# EAGLE schematic Power Controller 2.0 (EAGLE 6.4)
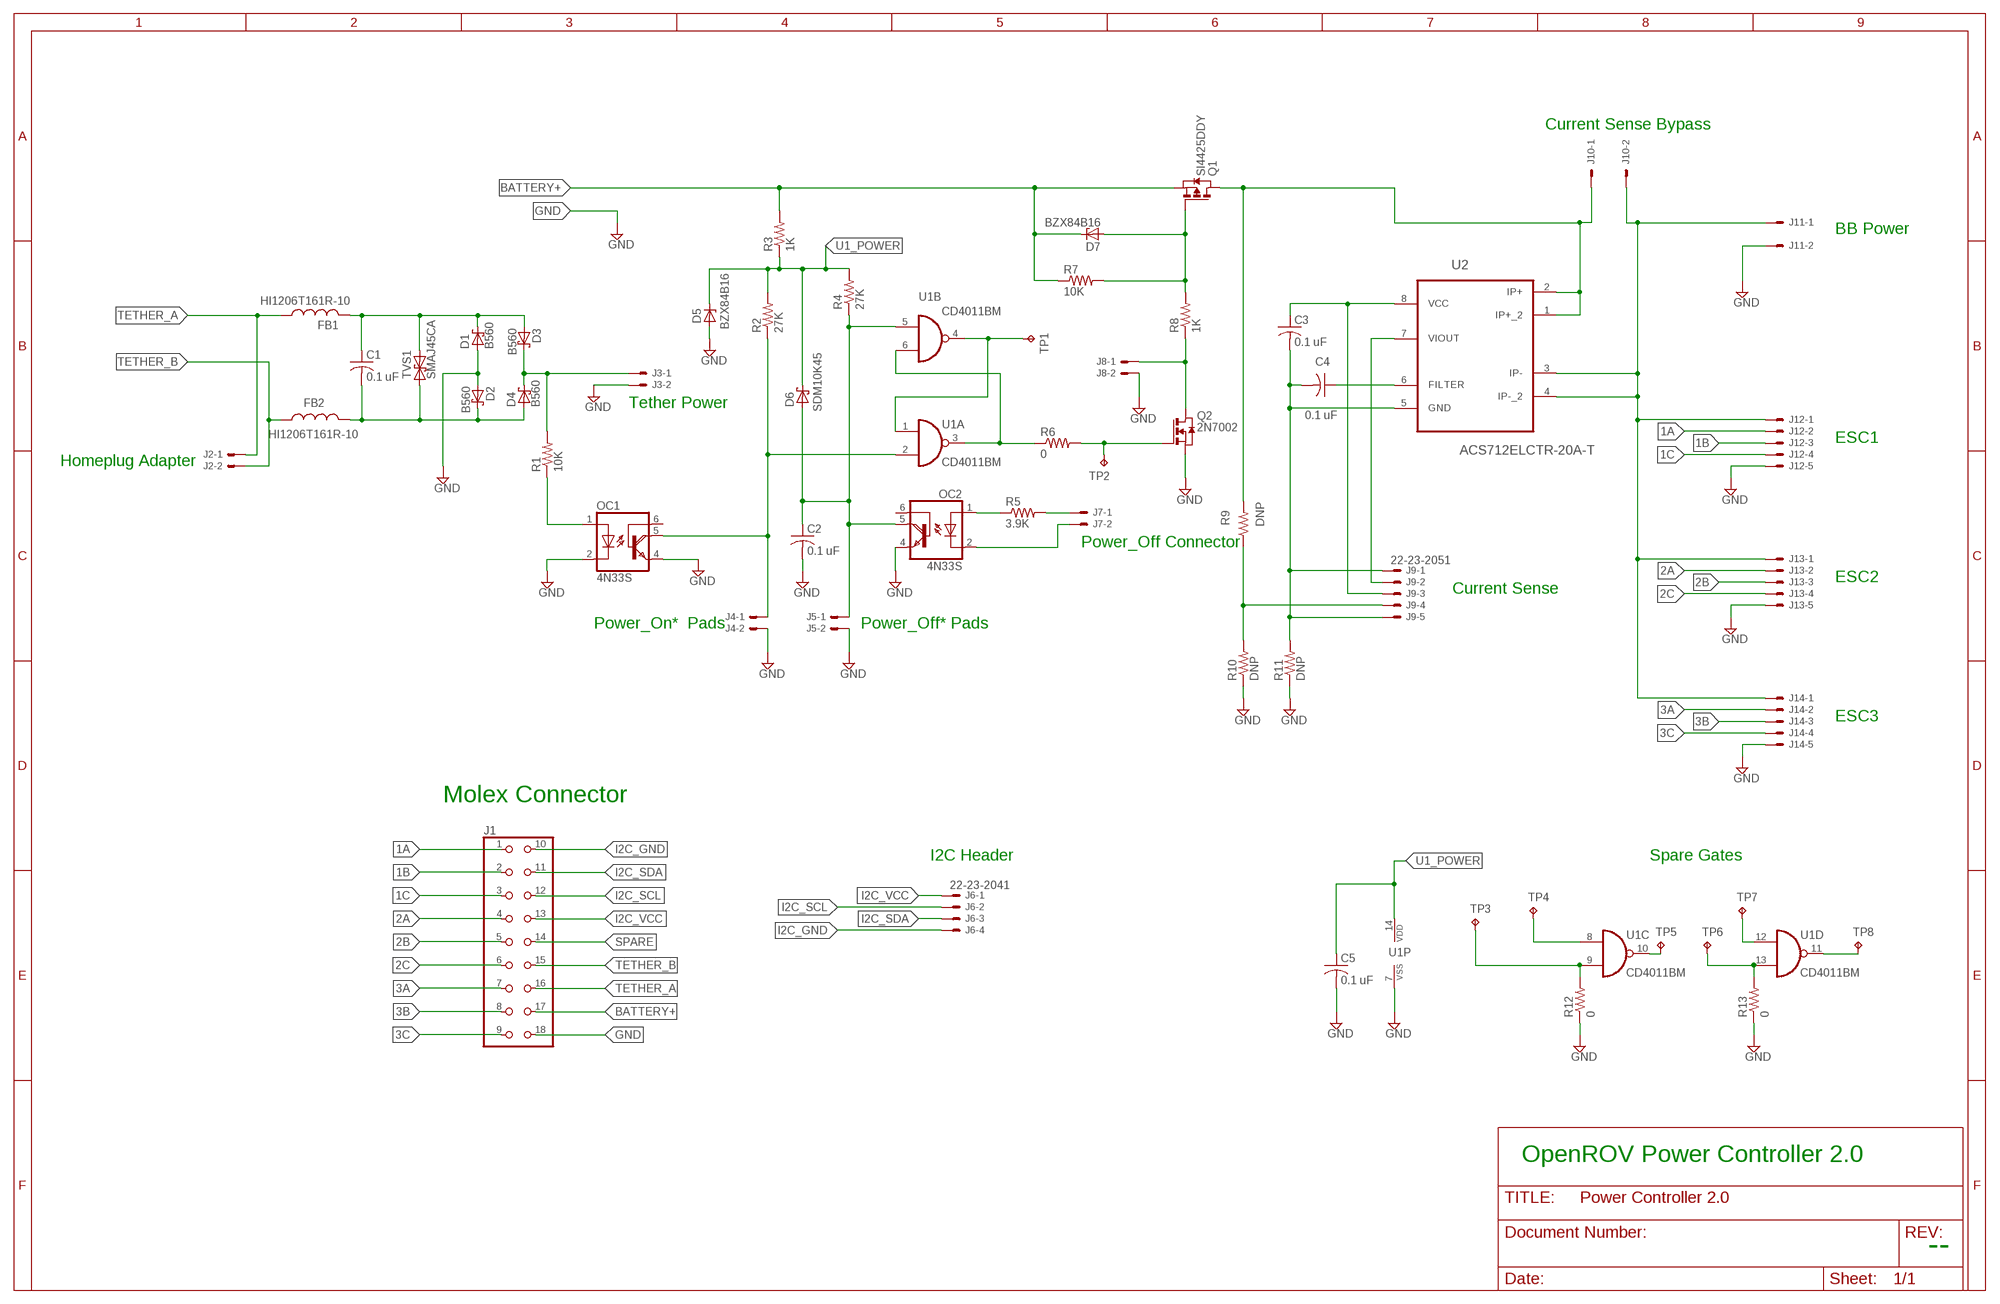
[diagram p0: schematic, sheet 1]

## Parts
C1  0.1 uF  C-USC0805K  [C0805K]
C2  0.1 uF  C-USC0805K  [C0805K]
C3  0.1 uF  C-USC0805K  [C0805K]
C4  0.1 uF  C-USC0805K  [C0805K]
C5  0.1 uF  C-USC0805K  [C0805K]
D1  B560  SCHOTTKY-DIODESMC  [SMC]
D2  B560  SCHOTTKY-DIODESMC  [SMC]
D3  B560  SCHOTTKY-DIODESMC  [SMC]
D4  B560  SCHOTTKY-DIODESMC  [SMC]
D5  BZX84B16  BZX84CSMD  [TO236]
D6  SDM10K45  SCHOTTKYSOD323  [SOD323]
D7  BZX84B16  BZX84CSMD  [TO236]
FB1  HI1206T161R-10  FERRITESIZE_1206  [R1206]
FB2  HI1206T161R-10  FERRITESIZE_1206  [R1206]
J1  MINI-FIT-JR-18  [MINI-FIT-JR-18-PEGS]
J2  22-23-2021  [22-23-2021]
J3  KK-156-2  [KK-156-2]
J4  22-23-2021  [22-23-2021]
J5  22-23-2021  [22-23-2021]
J6  22-23-2041  [22-23-2041]
J7  22-23-2021  [22-23-2021]
J8  22-23-2021  [22-23-2021]
J9  22-23-2051  [22-23-2051]
J10  KK-156-2  [KK-156-2]
J11  KK-156-2  [KK-156-2]
J12  ESC_PADSCUSTOM  [ESC-PADS]
J13  ESC_PADSCUSTOM  [ESC-PADS]
J14  ESC_PADSCUSTOM  [ESC-PADS]
OC1  4N33S  [DIL6-SMD]
OC2  4N33S  [DIL6-SMD]
Q1  SI4425DDY  PMOS-SO8  [SO8]
Q2  2N7002  NMOSSOT23  [SOT-23]
R1  10K  R-US_R0805  [R0805]
R2  27K  R-US_R0805  [R0805]
R3  1K  R-US_R0805  [R0805]
R4  27K  R-US_R0805  [R0805]
R5  3.9K  R-US_R0805  [R0805]
R6  0  R-US_R0805  [R0805]
R7  10K  R-US_R0805  [R0805]
R8  1K  R-US_R0805  [R0805]
R9  DNP  R-US_R0805  [R0805]
R10  DNP  R-US_R0805  [R0805]
R11  DNP  R-US_R0805  [R0805]
R12  0  R-US_R0805  [R0805]
R13  0  R-US_R0805  [R0805]
TP1  TPPAD1-13  [P1-13]
TP2  TPPAD1-13  [P1-13]
TP3  TPPAD1-13  [P1-13]
TP4  TPPAD1-13  [P1-13]
TP5  TPPAD1-13  [P1-13]
TP6  TPPAD1-13  [P1-13]
TP7  TPPAD1-13  [P1-13]
TP8  TPPAD1-13  [P1-13]
TVS1  SMAJ45CA  TVS-BIDIRDO214-AC  [DO214AC]
U1  CD4011BM  4011D  [SO14]
U2  ACS712ELCTR-20A-T  [SOIC127P600X175-8N]

## Nets
1A [ESC]: J1.1 J12.2
1B [ESC]: J1.2 J12.3
1C [ESC]: J1.3 J12.4
2A [ESC]: J1.4 J13.2
2B [ESC]: J1.5 J13.3
2C [ESC]: J1.6 J13.4
3A [ESC]: J1.7 J14.2
3B [ESC]: J1.8 J14.3
3C [ESC]: J1.9 J14.4
BATTERY+ [Power]: D7.C J1.17 Q1.1(S) Q1.2(S) Q1.3(S) R3.2 R7.1
GND: C2.2 C5.2 D1.A D2.A D5.A J1.18 J3.2 J4.2 J5.2 J8.2 J11.2 J12.5 J13.5 J14.5 OC1.2(C) OC1.4(E) OC2.4(E) Q2.2(S) R10.1 R11.1 R12.1 R13.1 U1.7(P:VSS)
I2C_GND: J1.10 J6.4
I2C_SCL: J1.12 J6.2
I2C_SDA: J1.11 J6.3
I2C_VCC: J1.13 J6.1
N$1: R6.1 U1.3(A:O) U1.6(B:I1)
N$2: OC2.1(A) R5.1
N$3: R12.2 TP3.TP U1.9(C:I1)
N$4: R13.2 TP6.TP U1.13(D:I1)
N$5: TP5.TP U1.10(C:O)
N$6: TP8.TP U1.11(D:O)
N$7: D7.A Q1.4(G) R7.2 R8.2
N$8: Q2.3(G) R6.2 TP2.TP
N$9: J7.2 OC2.2(C)
N$10: TP4.TP U1.8(C:I0)
N$12: J8.1 Q2.1(D) R8.1
N$13: TP7.TP U1.12(D:I0)
N$14 [Power]: J10.1 Q1.5(D) Q1.6(D) Q1.7(D) Q1.8(D) R9.2 U2.1(IP+_2) U2.2(IP+)
N$15 [Tether]: C1.1 D1.C D3.A FB1.2 TVS1.C
N$16 [Tether]: C1.2 D2.C D4.A FB2.2 TVS1.A
N$17: OC1.1(A) R1.1
N$18: J9.4 R9.1 R10.2
N$19: C3.1 J9.3 U2.8(VCC)
N$20: C4.1 U2.6(FILTER)
N$21: C3.2 C4.2 J9.1 J9.5 R11.2 U2.5(GND)
N$23: J9.2 U2.7(VIOUT)
POWER_OFF*: C2.1 D6.2(A) J5.1 OC2.5(COL) R4.1 U1.5(B:I0)
POWER_ON*: J4.1 OC1.5(COL) R2.1 U1.2(A:I1)
POWER_SWITCH*: TP1.TP U1.1(A:I0) U1.4(B:O)
SOFT_POWER_OFF: J7.1 R5.2
SPARE: J1.14
TETHER_A [Tether]: FB1.1 J1.16 J2.1
TETHER_B [Tether]: FB2.1 J1.15 J2.2
TETHER_POWER [Tether]: D3.C D4.C J3.1 R1.2
U1_POWER: C5.1 D5.C D6.1(C) R2.2 R3.1 R4.2 U1.14(P:VDD)
V_BAT_SWITCHED [Power]: J10.2 J11.1 J12.1 J13.1 J14.1 U2.3(IP-) U2.4(IP-_2)
Unconnected: OC1.6(B) OC2.6(B)

## Notes on the sheet
- Current Sense Bypass
- BB Power
- Tether Power
- ESC1
- Homeplug Adapter
- Power_Off Connector
- ESC2
- Current Sense
- Power_On*  Pads | Power_Off* Pads
- ESC3
- Molex Connector
- I2C Header | Spare Gates
- OpenROV Power Controller 2.0
- --

## Library data of the parts
C1-C5 = rcl:C-US: CAPACITOR, American symbol
D1-D4 = diode:SCHOTTKY-DIODE: Schottky Diode
D5 D7 = diode:BZX84CSMD: Z DIODE
D6 = Walts_Generic_Parts:SCHOTTKY: Silicon Schottky Diodes
FB1 FB2 = Walts_Generic_Parts:FERRITE: Generic Surface Mount Ferrite Chip
J1 = OpenROV_Library:MINI-FIT-JR-18: Molex Mini-Fit JR 18-position
J2 J4 J5 J7 J8 = con-molex:22-23-2021: .100" (2.54mm) Center Header - 2 Pin; MF: MOLEX; MPN: 22-23-2021; OC_FARNELL: 1462926; OC_NEWARK: 25C3832
J3 J10 J11 = con-molex:KK-156-2: KK 156 HEADER Source: http://www.molex.com/pdm_docs/sd/026604100_sd.pdf; OC_FARNELL: unknown; OC_NEWARK: unknown
J6 = con-molex:22-23-2041: .100" (2.54mm) Center Header - 4 Pin; MF: MOLEX; MPN: 22-23-2041; OC_FARNELL: 1462920; OC_NEWARK: 38C0355
J9 = con-molex:22-23-2051: .100" (2.54mm) Center Header - 5 Pin; MF: MOLEX; MPN: 22-23-2051; OC_FARNELL: 1462952; OC_NEWARK: 38C9178
J12-J14 = OpenROV_Library:ESC_PADS: KK 156 HEADER Source: http://www.molex.com/pdm_docs/sd/026604100_sd.pdf
OC1 OC2 = OpenROV_Library:4N33: MOTOROLA OPTO COUPLER
Q1 = OpenROV_Library:PMOS-SO8: MOS FET
Q2 = zetex:NMOSSOT23: MOS FET; OC_FARNELL: unknown; OC_NEWARK: unknown
R1-R13 = rcl:R-US_: RESISTOR, American symbol
TP1-TP8 = testpad:TP: Test pad
TVS1 = Walts_Generic_Parts:TVS-BIDIR
U1 = 40xx:4011: Quad 2-input NAND
U2 = OpenROV_Library:ACS712ELCTR-20A-T: Linear Current Sensor; MPN: ACS712ELCTR-20A-T; OC_FARNELL: 1329624; OC_NEWARK: 31M3133; PACKAGE: SOIC-8; SUPPLIER: Allegro

## Net classes
0 default: width 0.381 mm, drill 0.508 mm, clearance 0.254 mm
1 ESC: width 1.676 mm, drill 0.762 mm, clearance 0.381 mm to class 0, clearance 0.381 mm
2 Power: width 2.286 mm, drill 1.016 mm, clearance 0.381 mm to class 0, clearance 0.381 mm to class 1, clearance 0.381 mm
3 Tether: width 2.032 mm, drill 1.016 mm, clearance 0.508 mm to class 0, clearance 0.508 mm to class 1, clearance 0.508 mm to class 2, clearance 0.508 mm